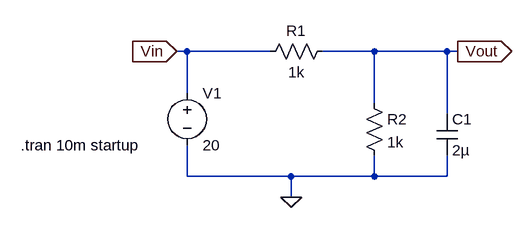
[diagram p0: schematic Draft2.asc]
Draft2.asc, the LTspice schematic file:
Version 4
SHEET 1 880 680
WIRE -16 64 -32 64
WIRE 112 64 -16 64
WIRE 272 64 192 64
WIRE 384 64 272 64
WIRE 400 64 384 64
WIRE -16 128 -16 64
WIRE 272 144 272 64
WIRE 384 160 384 64
WIRE -16 256 -16 208
WIRE 144 256 -16 256
WIRE 272 256 272 224
WIRE 272 256 144 256
WIRE 384 256 384 224
WIRE 384 256 272 256
WIRE 144 288 144 256
FLAG 144 288 0
FLAG -32 64 Vin
IOPIN -32 64 In
FLAG 400 64 Vout
IOPIN 400 64 Out
SYMBOL res 208 48 R90
WINDOW 0 0 56 VBottom 2
WINDOW 3 32 56 VTop 2
SYMATTR InstName R1
SYMATTR Value 1k
SYMBOL res 256 128 R0
SYMATTR InstName R2
SYMATTR Value 1k
SYMBOL cap 368 160 R0
SYMATTR InstName C1
SYMATTR Value 2µ
SYMBOL voltage -16 112 R0
WINDOW 123 0 0 Left 0
WINDOW 39 0 0 Left 0
SYMATTR InstName V1
SYMATTR Value 20
TEXT -272 208 Left 2 !.tran 10m startup

The netlist it stands for:
* Draft2.asc
R1 Vout Vin 1k
R2 Vout 0 1k
C1 Vout 0 2µ
V1 Vin 0 20
.tran 10m startup
.backanno
.end

* Results of the author's LTspice run, read from the files saved beside the schematic
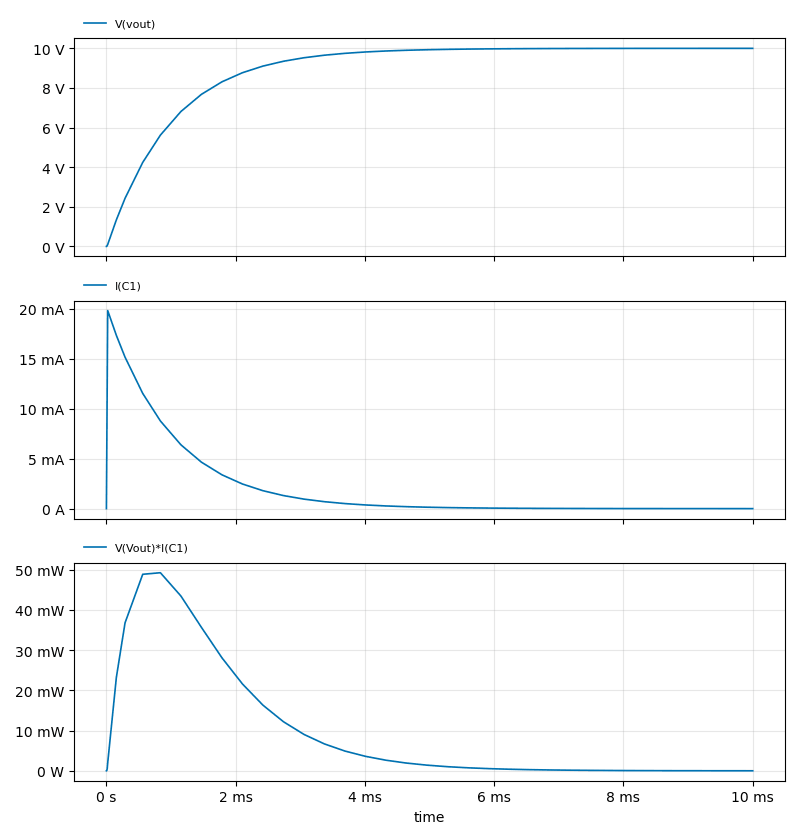
[diagram p1: Transient Analysis of Draft2.asc, plotted from the saved traces]
* Transient Analysis, 1 run:
*   V(vout): min 0 V, max 10 V, average 8.984 V, rms 9.213 V, last 10 V
*   I(C1): min 0 A, max 19.8 mA, average 2.012 mA, rms 4.499 mA, last 917.1 nA
*   V(Vout)*I(C1): min 0 W, max 49.23 mW, average 9.936 mW, rms 18.18 mW, last 9.17 µW